# EAGLE design littlebits_per (EAGLE 9.0.1)
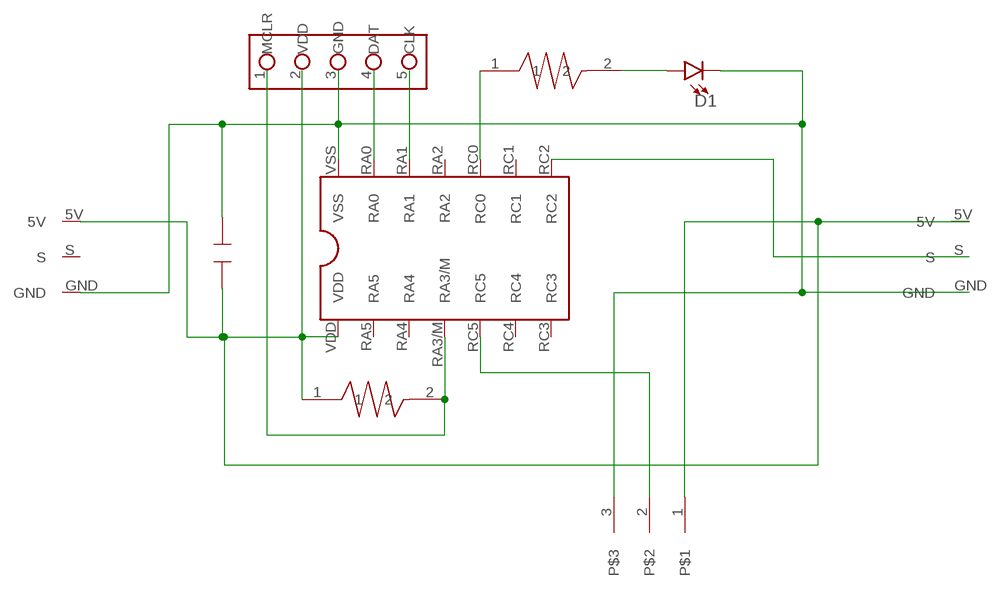
[diagram p0: schematic, sheet 1]

## Parts
D1  LED-3MM-NO_SILK  [LED_3MM-NS]
U$1  ICSP  [ICSP]
U$2  14PIN_DIP  [14PIN_DIP]
U$3  RESISTOR  [RESISTOR]
U$4  CAP-CERAMIC  [CAP-CERAMIC]
U$5  LITTLEBITS_CON  [LITTLEBITS_CON]
U$6  LITTLEBITS_CON  [LITTLEBITS_CON]
U$7  CON3  [CON3]
U$8  RESISTOR  [RESISTOR]

## Nets
N$1: U$2.RC5 U$7.2
N$2: U$1.4(DAT) U$2.RA0
N$3: U$1.5(CLK) U$2.RA1
N$4: U$1.2(VDD) U$2.VDD U$3.1 U$4.1 U$5.5V U$6.5V U$7.1
N$5: U$1.1(MCLR) U$2.RA3/M U$3.2
N$6: U$2.RC0 U$8.1
N$9: U$2.RC2 U$6.S
N$10: D1.A U$8.2
N$11: D1.K(C) U$1.3(GND) U$2.VSS U$4.2 U$5.GND U$6.GND U$7.3
Unconnected: U$2.RA2 U$2.RA4 U$2.RA5 U$2.RC1 U$2.RC3 U$2.RC4 U$5.S

## Library data of the parts
D1 = SparkFun-LED:LED: LED (Generic) Standard schematic elements and footprints for 5mm, 3mm, 1206, and 0603 sized LEDs. Generic LEDs with no color specified.
U$1 = ICSP:ICSP
U$2 = 8PIN_DIP:14PIN_DIP
U$3 U$8 = RESISTOR:RESISTOR
U$4 = CAP-CERAMIC:CAP-CERAMIC
U$5 U$6 = littleBits_con:LITTLEBITS_CON
U$7 = CONNECTER:CON3

## Board
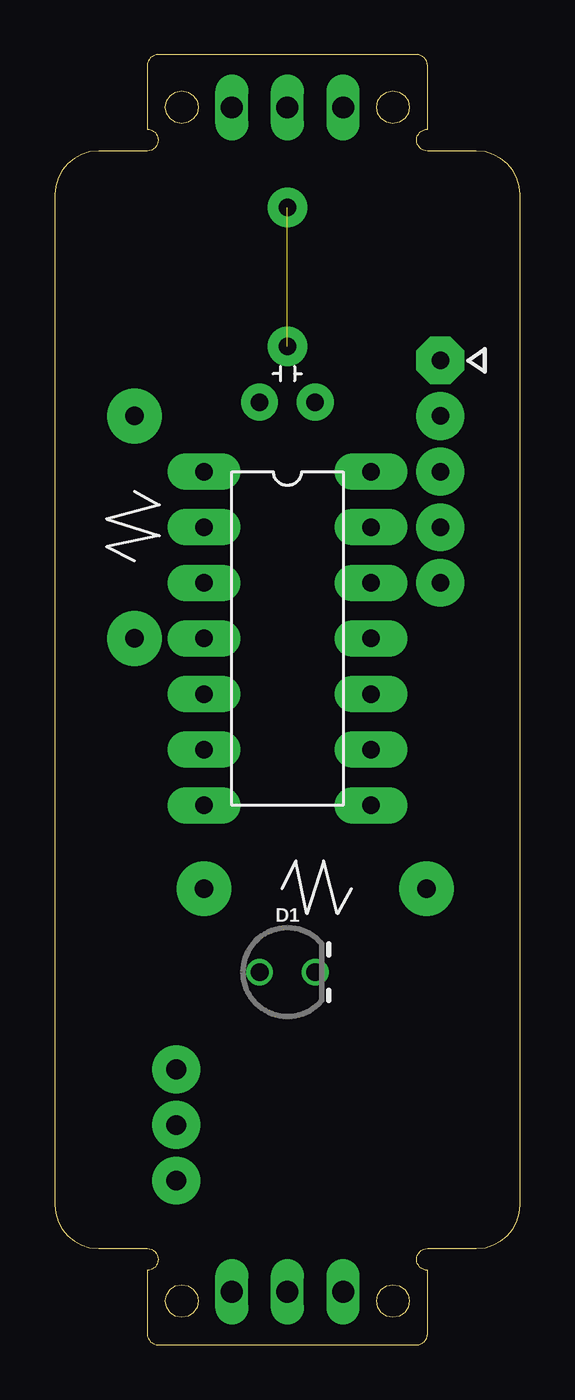
[diagram p1: board, top side]
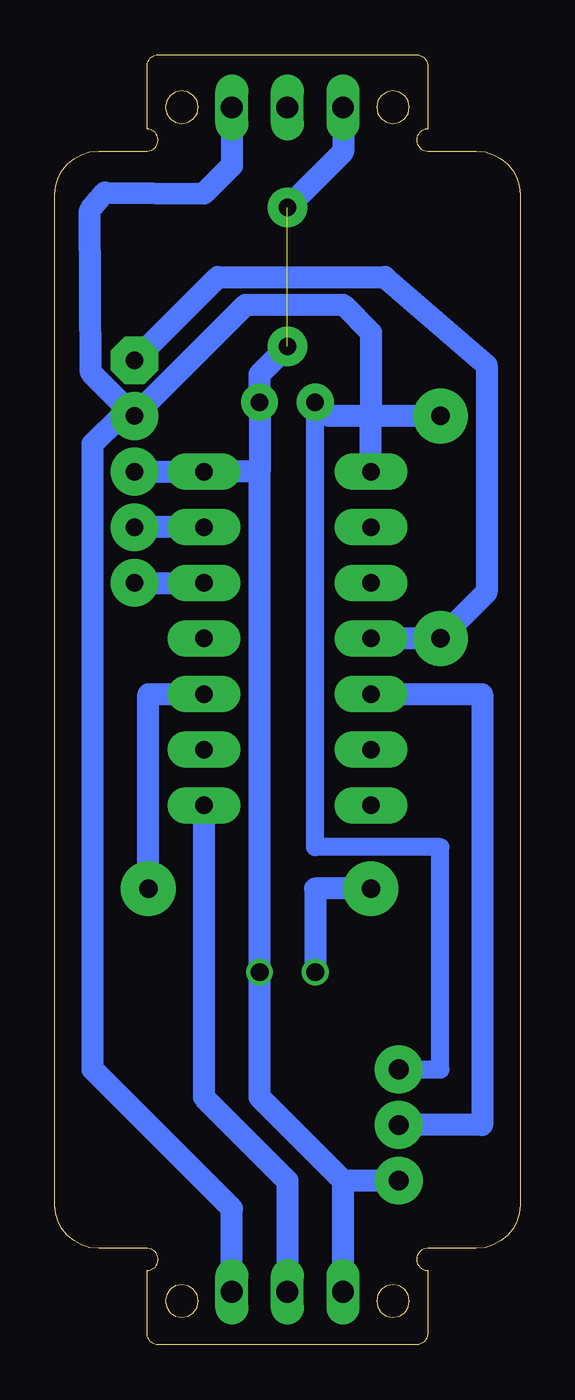
[diagram p2: board, bottom side, seen from below]

Size 21.25 x 58.93 mm. Coordinates in mm from the lower left corner, seen from the top.
Outline: 19.25,54.53 17.02,54.53 16.92,54.54 16.83,54.57 16.75,54.62 16.67,54.68 16.61,54.75 16.56,54.84 16.54,54.93 16.52,55.03 16.54,55.13 16.56,55.22 16.61,55.31 16.67,55.38 16.75,55.44 16.83,55.49 16.92,55.52 17.02,55.53 17.02,58.43 17.02,58.53 16.99,58.62 16.94,58.71 16.88,58.78 16.8,58.84 16.72,58.89 16.63,58.92 16.52,58.93 4.72,58.93 4.62,58.92 4.53,58.89 4.45,58.84 4.37,58.78 4.31,58.71 4.26,58.62 4.24,58.53 4.22,58.43 4.22,55.53 4.33,55.52 4.42,55.49 4.5,55.44 4.58,55.38 4.64,55.31 4.69,55.22 4.71,55.13 4.72,55.03 4.71,54.93 4.69,54.84 4.64,54.75 4.58,54.68 4.5,54.62 4.42,54.57 4.33,54.54 4.22,54.53 2,54.53 1.6,54.49 1.22,54.37 0.88,54.19 0.59,53.94 0.34,53.65 0.16,53.31 0.04,52.93 0,52.53 0,6.4 0.04,6 0.16,5.62 0.34,5.28 0.59,4.99 0.88,4.74 1.22,4.56 1.6,4.44 2,4.4 4.22,4.4 4.33,4.39 4.42,4.36 4.5,4.31 4.58,4.25 4.64,4.18 4.69,4.09 4.71,4 4.72,3.9 4.71,3.8 4.69,3.71 4.64,3.62 4.58,3.55 4.5,3.48 4.42,3.44 4.33,3.41 4.22,3.4 4.22,0.5 4.24,0.4 4.26,0.3 4.31,0.22 4.37,0.15 4.45,0.08 4.53,0.04 4.62,0.01 4.72,0 16.52,0 16.63,0.01 16.72,0.04 16.8,0.08 16.88,0.15 16.94,0.22 16.99,0.3 17.02,0.4 17.02,0.5 17.02,3.4 16.92,3.41 16.83,3.44 16.75,3.48 16.67,3.55 16.61,3.62 16.56,3.71 16.54,3.8 16.52,3.9 16.54,4 16.56,4.09 16.61,4.18 16.67,4.25 16.75,4.31 16.83,4.36 16.92,4.39 17.02,4.4 19.25,4.4 19.65,4.44 20.03,4.56 20.37,4.74 20.66,4.99 20.91,5.28 21.09,5.62 21.21,6 21.25,6.4 21.25,52.53 21.21,52.93 21.09,53.31 20.91,53.65 20.66,53.94 20.37,54.19 20.03,54.37 19.65,54.49 19.25,54.53
Outline: 6.55,56.53 6.5,56.24 6.33,56 6.1,55.84 5.8,55.78 5.51,55.84 5.27,56 5.11,56.24 5.05,56.53 5.11,56.82 5.27,57.06 5.51,57.22 5.8,57.28 6.1,57.22 6.33,57.06 6.5,56.82 6.55,56.53
Outline: 16.2,56.53 16.14,56.24 15.97,56 15.74,55.84 15.45,55.78 15.15,55.84 14.91,56 14.75,56.24 14.7,56.53 14.75,56.82 14.91,57.06 15.15,57.22 15.45,57.28 15.74,57.22 15.97,57.06 16.14,56.82 16.2,56.53
Outline: 6.55,2 6.5,1.71 6.33,1.47 6.1,1.31 5.8,1.25 5.51,1.31 5.27,1.47 5.11,1.71 5.05,2 5.11,2.29 5.27,2.53 5.51,2.69 5.8,2.75 6.1,2.69 6.33,2.53 6.5,2.29 6.55,2
Outline: 16.2,2 16.14,1.71 15.97,1.47 15.74,1.31 15.45,1.25 15.15,1.31 14.91,1.47 14.75,1.71 14.7,2 14.75,2.29 14.91,2.53 15.15,2.69 15.45,2.75 15.74,2.69 15.97,2.53 16.14,2.29 16.2,2
Copper layers (1*16): Top 0.035mm / dielectric 1.6mm / Bottom 0.035mm
Design rules "Elecrow_2-layer_PCB_eagle_rule": minimum track width 6mil, minimum drill 12mil, track to track 6mil, track to pad 6mil, pad to pad 6mil, via to via 8mil, smd to smd 0mil, copper to edge 20mil, drill to drill 10mil, minimum pad ring 6mil, minimum via ring 6mil, stop-mask expansion 0mil, vias tented up to drill 100mil, thermal gap 10mil

### Footprints (pad centres in the part's own frame; a part is rotated, then mirrored left to right if it is on the bottom)
LED_3MM-NS = drill 0.813: A -1.27,0; K 1.27,0
ICSP = drill 0.8 pad 2.184 octagon: 1 -5.08,0 | drill 0.8 pad 2.184: 2 -2.54,0; 3 0,0; 4 2.54,0; 5 5.08,0
14PIN_DIP = drill 0.8 pad 1.676 long: RA0 -5.08,3.81; RA1 -2.54,3.81; RA2 0,3.81; RA3/M 0,-3.81; RA4 -2.54,-3.81; RA5 -5.08,-3.81; RC0 2.54,3.81; RC1 5.08,3.81; RC2 7.62,3.81; RC3 7.62,-3.81; RC4 5.08,-3.81; RC5 2.54,-3.81; VDD -7.62,-3.81; VSS -7.62,3.81
RESISTOR = drill 0.85 pad 2.5: 1 -5.08,0; 2 5.08,0
CAP-CERAMIC = drill 0.8 pad 1.676: 1 -1.27,0; 2 1.27,0
LITTLEBITS_CON = drill 1 pad 1.4 long: 5V 2.54,0; GND -2.54,0; S 0,0
CON3 = drill 0.9 pad 2.184: 1 -2.54,0; 2 0,0; 3 2.54,0

### Placement (x,y rotation side)
D1  10.62,17.02 0 top
U$1  17.61,39.89 270 top
U$2  10.62,32.27 270 top
U$3  3.64,37.35 270 top
U$4  10.62,43.06 0 top
U$5  10.62,56.52 0 top
U$6  10.62,2.42 0 top
U$7  5.54,10.04 270 top
U$8  11.89,20.83 180 top

### Tracks (layer width: path | path; a pad name or v marks a point on that pad's centre or on a via)
N$1
  Bottom 1.016: U$2.RC5 1.74,29.72 1.74,10.04 U$7.2
N$2
  Bottom 1.016: U$2.RA0 U$1.4
N$3
  Bottom 1.016: U$1.5 U$2.RA1
N$4
  Bottom 0.813: U$7.1 3.64,12.58 3.64,22.74 9.36,22.74 U$4.1
  Bottom 1.016: U$3.1 6.81,42.43 | 6.81,42.43 8.72,42.43 U$4.1 | U$2.VDD 6.81,42.43 | U$5.5V 13.16,53.86 14.44,52.59 18.96,52.63 19.64,51.82 19.6,44.46 19.6,44.41 U$1.2 | U$6.5V 13.16,6.23 19.52,12.58 19.52,41.16 18.25,42.43 U$1.2 | 6.81,42.43 6.81,46.23 8.09,47.51 12.53,47.51 U$1.2
N$5
  Bottom 1.016: U$2.RA3/M U$3.2 1.53,34.38 1.53,44.75 6.18,48.78 13.8,48.78 U$1.1
N$6
  Bottom 1.016: U$8.1 16.98,29.72 U$2.RC0
N$7  (via drill 0.8 pad 1.8)
  other vias: 10.62,45.6
N$8  (via drill 0.8 pad 1.8)
  other vias: 10.62,51.95
N$9
  Bottom 1.016: U$2.RC2 14.44,11.31 10.62,7.5 U$6.S
N$10
  Bottom 1.016: U$8.2 9.36,20.83 D1.A
N$11  (1 unrouted)
  Bottom 1.016: 11.89,39.89 U$4.2 11.89,44.33 10.62,45.6 | 11.89,39.89 U$2.VSS U$1.3 | 11.89,39.89 D1.K 11.89,11.31 8.09,7.5 | U$5.GND 8.09,54.49 10.62,51.95 | U$7.3 8.09,7.5 | U$6.GND 8.09,7.5